# Altium schematic sheet nguonsche.SchDoc
size A
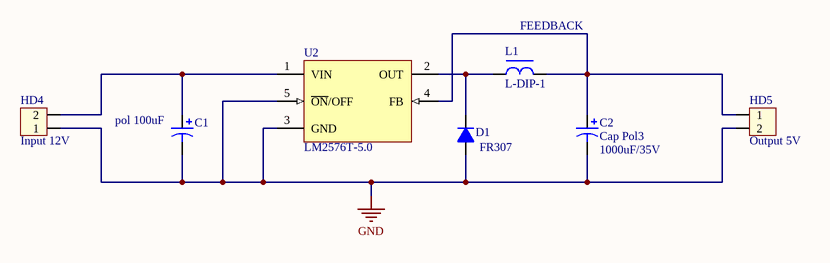
[diagram p0: nguonsche.SchDoc]

## Parts
C1  pol 100uF  [C10mm]
C2  Cap Pol3  value 1000uF/35V  [CP2/5]
D1  FR307  [D2A]
HD4  Input 12V  [HED2]
HD5  Output 5V  [HED2]
L1  L-DIP-1  [L-DIP-M-5.3]
U2  LM2576T-5.0  [LM2576t]

## Nets
GND: C1.2 C2.2 D1.1(A) HD4.1 HD5.2 U2.3(GND) U2.5(~{ON}/OFF)
NetC1_1: C1.1 HD4.2 U2.1(VIN)
NetC2_1: C2.1 HD5.1 L1.2 U2.4(FB)
NetD1_2: D1.2(K) L1.1 U2.2(OUT)

## Notes on the sheet
- (near L1) FEEDBACK

## Library data of the parts
C1 = Cap Pol 12mm: Polarized Capacitor (Axial); Published: 8-Jun-2000; LatestRevisionDate: 17-Jul-2002; LatestRevisionNote: Re-released for DXP Platform.; PackageReference: POLAR0.8; Publisher: Altium Limited
C2 = Cap Pol3: Polarized Capacitor (Surface Mount); VALUE: C?; LatestRevisionDate: 17-Jul-2002; LatestRevisionNote: Re-released for DXP Platform.; PackageReference: C0805; Publisher: Altium Limited
D1 = D1A: Diode 1A; Value: 1N4007
HD4 HD5 = Hed2: Header 2 (Green); Value: Header 2
L1 = L-DIP-1: Inductor; Value: 150 mH
U2 = LM2576T-5.0: SIMPLE SWITCHER; 3A Step-Down Voltage Regulator; Manufacturer: National Semiconductor; PackageTopMarking: NSUZXYTT*LM2576T*-5.0 P+; PowerWise: N; FirstPublished: 4-Dec-2008; DatasheetVersion: Aug-2004; PackageVersion: revJ, Jan-1992; PackageReference: T05A; Publisher: Altium Limited; PackageDescription: TO-220, Molded, 5 Lead, Straight; CompType: Switcher; PartNumber: LM2576T-5.0; RoHS: O; PinCount: 5; DigiKeyPartNumber: LM2576T-5.0-ND; Code_JEDEC: TO-220-AB; ComponentLink1Description: LM2576 Datasheet; ComponentLink1URL: http://www.national.com/ds/LM/LM2576.pdf; ComponentLink2Description: LM2576 Web Page; ComponentLink2URL: http://www.national.com/pf/LM/LM2576.html; ComponentLink3Description: T05A Package Page; ComponentLink3URL: http://www.national.com/packaging/folders/t05a.html